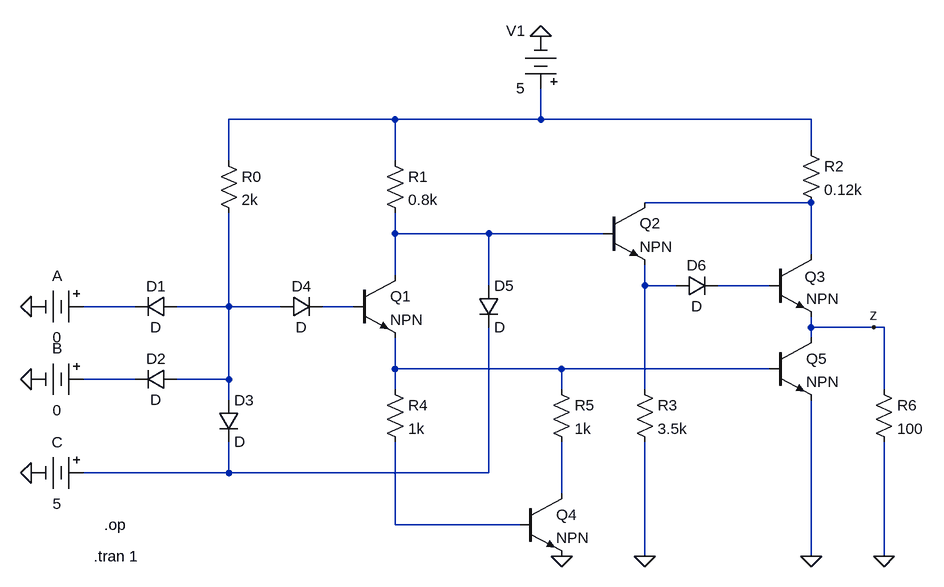
[diagram p0: schematic Draft12.asc]
Draft12.asc, the LTspice schematic file:
Version 4
SHEET 1 1140 680
WIRE 320 -208 64 -208
WIRE 544 -208 544 -256
WIRE 544 -208 320 -208
WIRE 960 -208 544 -208
WIRE 960 -160 960 -208
WIRE 64 -144 64 -208
WIRE 320 -144 320 -208
WIRE 960 -80 704 -80
WIRE 320 -32 320 -64
WIRE 464 -32 320 -32
WIRE 640 -32 464 -32
WIRE 960 0 960 -80
WIRE 320 32 320 -32
WIRE 464 48 464 -32
WIRE 704 48 704 16
WIRE 752 48 704 48
WIRE 896 48 816 48
WIRE -80 80 -160 80
WIRE 64 80 64 -64
WIRE 64 80 -16 80
WIRE 144 80 64 80
WIRE 256 80 208 80
WIRE 960 112 960 96
WIRE 1056 112 960 112
WIRE 1072 112 1056 112
WIRE 960 128 960 112
WIRE 320 176 320 128
WIRE 576 176 320 176
WIRE 896 176 576 176
WIRE -80 192 -160 192
WIRE 64 192 64 80
WIRE 64 192 -16 192
WIRE 320 208 320 176
WIRE 576 208 576 176
WIRE 704 208 704 48
WIRE 1072 208 1072 112
WIRE 64 224 64 192
WIRE 64 336 64 288
WIRE 64 336 -160 336
WIRE 464 336 464 112
WIRE 464 336 64 336
WIRE 576 368 576 288
WIRE 320 416 320 288
WIRE 512 416 320 416
WIRE 704 464 704 288
WIRE 960 464 960 224
WIRE 1072 464 1072 288
FLAG 576 464 0
FLAG 704 464 0
FLAG 960 464 0
FLAG 1056 112 z
FLAG -240 80 0
FLAG -240 192 0
FLAG -240 336 0
FLAG 1072 464 0
FLAG 544 -336 0
SYMBOL diode -16 64 R90
WINDOW 0 0 32 VBottom 2
WINDOW 3 32 32 VTop 2
SYMATTR InstName D1
SYMBOL diode -16 176 R90
WINDOW 0 0 32 VBottom 2
WINDOW 3 32 32 VTop 2
SYMATTR InstName D2
SYMBOL diode 48 224 R0
SYMATTR InstName D3
SYMBOL diode 144 96 R270
WINDOW 0 32 32 VTop 2
WINDOW 3 0 32 VBottom 2
SYMATTR InstName D4
SYMBOL diode 448 48 R0
SYMATTR InstName D5
SYMBOL diode 752 64 R270
WINDOW 0 32 32 VTop 2
WINDOW 3 0 32 VBottom 2
SYMATTR InstName D6
SYMBOL res 304 -160 R0
SYMATTR InstName R1
SYMATTR Value 0.8k
SYMBOL res 944 -176 R0
SYMATTR InstName R2
SYMATTR Value 0.12k
SYMBOL res 688 192 R0
SYMATTR InstName R3
SYMATTR Value 3.5k
SYMBOL res 304 192 R0
SYMATTR InstName R4
SYMATTR Value 1k
SYMBOL res 560 192 R0
SYMATTR InstName R5
SYMATTR Value 1k
SYMBOL res 48 -160 R0
SYMATTR InstName R0
SYMATTR Value 2k
SYMBOL npn 256 32 R0
SYMATTR InstName Q1
SYMBOL npn 640 -80 R0
SYMATTR InstName Q2
SYMBOL npn 896 0 R0
WINDOW 0 54 34 Left 2
SYMATTR InstName Q3
SYMBOL npn 512 368 R0
SYMATTR InstName Q4
SYMBOL npn 896 128 R0
SYMATTR InstName Q5
SYMBOL Misc\\battery -144 80 R90
WINDOW 0 -32 56 VBottom 2
WINDOW 3 32 56 VTop 2
WINDOW 123 0 0 Left 0
WINDOW 39 0 0 Left 0
SYMATTR InstName A
SYMATTR Value 0
SYMBOL Misc\\battery -144 192 R90
WINDOW 0 -32 56 VBottom 2
WINDOW 3 32 56 VTop 2
WINDOW 123 0 0 Left 0
WINDOW 39 0 0 Left 0
SYMATTR InstName B
SYMATTR Value 0
SYMBOL Misc\\battery -144 336 R90
WINDOW 0 -32 56 VBottom 2
WINDOW 3 32 56 VTop 2
WINDOW 123 0 0 Left 0
WINDOW 39 0 0 Left 0
SYMATTR InstName C
SYMATTR Value 5
SYMBOL res 1056 192 R0
SYMATTR InstName R6
SYMATTR Value 100
SYMBOL Misc\\battery 544 -240 R180
WINDOW 0 24 104 Left 2
WINDOW 3 24 16 Left 2
WINDOW 123 0 0 Left 0
WINDOW 39 0 0 Left 0
SYMATTR InstName V1
SYMATTR Value 5
TEXT -128 416 Left 2 !.op
TEXT -144 464 Left 2 !.tran 1

The netlist it stands for:
* Draft12.asc
D1 N007 N006 D
D2 N007 N010 D
D3 N007 N011 D
D4 N007 N008 D
D5 N003 N011 D
D6 N004 N005 D
R1 N001 N003 0.8k
R2 N001 N002 0.12k
R3 N004 0 3.5k
R4 N009 N013 1k
R5 N009 N012 1k
R0 N001 N007 2k
Q1 N003 N008 N009 0 NPN
Q2 N002 N003 N004 0 NPN
Q3 N002 N005 z 0 NPN
Q4 N012 N013 0 0 NPN
Q5 z N009 0 0 NPN
V§A N006 0 0
V§B N010 0 0
V§C N011 0 5
R6 z 0 100
V1 N001 0 5
.model D D
.lib standard.dio
.model NPN NPN
.model PNP PNP
.lib standard.bjt
.op
.tran 1
.backanno
.end